# EAGLE design THS Joule Thief torch (EAGLE 6.4)
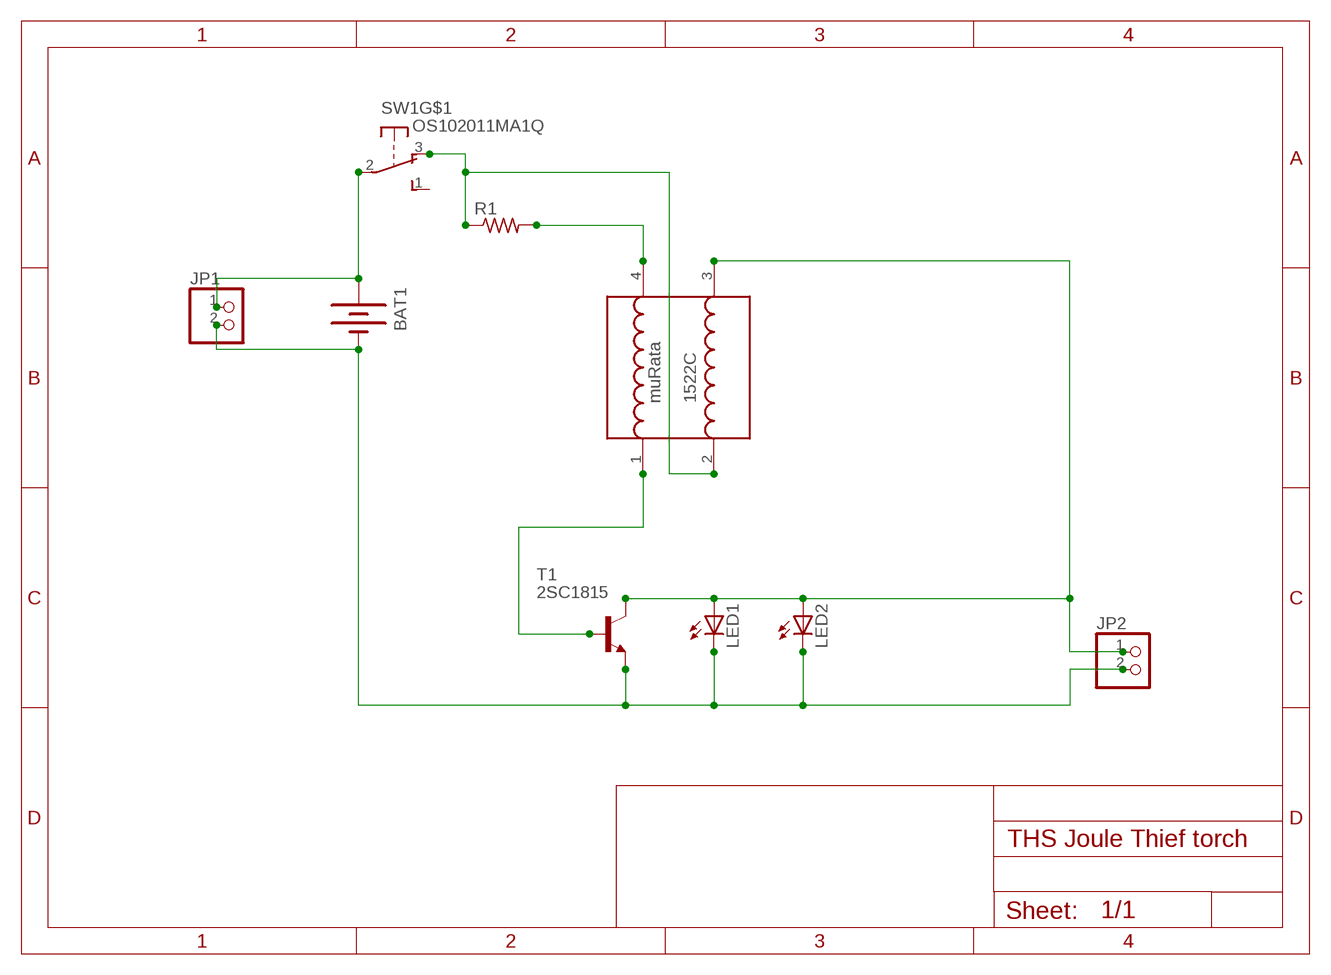
[diagram p0: schematic, sheet 1]

## Parts
BAT1  BATTERY  [BATTERY-AA-PANEL-AKIZUKI]
JP1  PINHD-1X2  [1X02]
JP2  PINHD-1X2  [1X02]
LED1  LED5MM  [LED5MM]
LED2  LED5MM  [LED5MM]
R1  R-US_0204/7  [0204/7]
SW1  OS102011MA1Q  [OS102011MA1Q]
T1  2SC1815  [TO92-ECB]
U$1  1522C_MURATA_AC-CHOKE  [AC-CHOKE_THROUGH_HOLE]

## Nets
GND: BAT1.- JP1.2 JP2.2 LED1.K(C) LED2.K(C) T1.E
N$2: R1.2 U$1.4(COIL1_B)
N$5: T1.B U$1.1(COIL1_A)
N$6: BAT1.+ JP1.1 SW1.2(P)
N$15: JP2.1 LED1.A LED2.A T1.C U$1.3(COIL2_B)
VCC: R1.1 SW1.3(O) U$1.2(COIL2_A)
Unconnected: SW1.1(S) SW1.MT1(MT) SW1.MT2(MT)

## Library data of the parts
BAT1 = DIY-SciB.org:BATTERY: Battery Holders Various common sizes : AA, AAA, 20mm coin cell and 12mm coin cell. 20MM_4LEGS, BATT-10373
JP1 JP2 = pinhead:PINHD-1X2: PIN HEADER
LED1 LED2 = adafruit:LED: LED OSRAM: - CHIPLED LG R971, LG N971, LY N971, LG Q971, LY Q971, LO R971, LY R971 LH N974, LH R974 LS Q976, LO Q976, LY Q976 LO Q996 - Hyper CHIPLED LW Q18S LB Q993, LB Q99A, LB R99A - SideLED LS A670, LO A670, LY A670, LG A670, LP A670 LB A673, LV A673, LT A673, LW A673 LH A674 LY A675 LS A676, LA A676, LO A676, LY A676, LW A676 LS A679, LY A679, LG A679 - Hyper Micro SIDELED® LS Y876, LA Y876, LO Y876, LY Y876 LT Y87S - SmartLED LW L88C, LW L88S LB L89C, LB L89S, LG L890 LS L89K, LO L89K, LY L89K LS L896, LA L896, LO L896, LY L896 - TOPLED LS T670, LO T670, LY T670, LG T670, LP T670 LSG T670, LSP T670, LSY T670, LOP T670, LYG T670 LG T671, LOG T671, LSG T671 LB T673, LV T673, LT T673, LW T673 LH T674 LS T676, LA T676, LO T676, LY T676, LB T676, LH T676, LSB T676, LW T676 LB T67C, LV T67C, LT T67C, LS T67K, LO T67K, LY T67K, LW E67C LS E67B, LA E67B, LO E67B, LY E67B, LB E67C, LV E67C, LT E67C LW T67C LS T679, LY T679, LG T679 LS T770, LO T770, LY T770, LG T770, LP T770 LB T773, LV T773, LT T773, LW T773 LH T774 LS E675, LA E675, LY E675, LS T675 LS T776, LA T776, LO T776, LY T776, LB T776 LHGB T686 LT T68C, LB T68C - Hyper Mini TOPLED® LB M676 - Mini TOPLED Santana® LG M470 LS M47K, LO M47K, LY M47K Source: http://www.osram.convergy.de/
R1 = adafruit:R-US_: RESISTOR, American symbol
SW1 = adafruit:OS102011MA1Q: OS10201MA1Q through-hole right angle switch http://www.ladyada.net/library/eagle
T1 = transistor:2SC1815: NPN EPITAXIAL TRANSISTOR Source: TOSHIBA .. 2SC1815 1.pdf
U$1 = DIY-SciB.org:1522C_MURATA_AC-CHOKE: muRata AC-choke 1522C Two coils wound around a core No data available online. From the Tokyo HackerSpace auction buy.

## Board
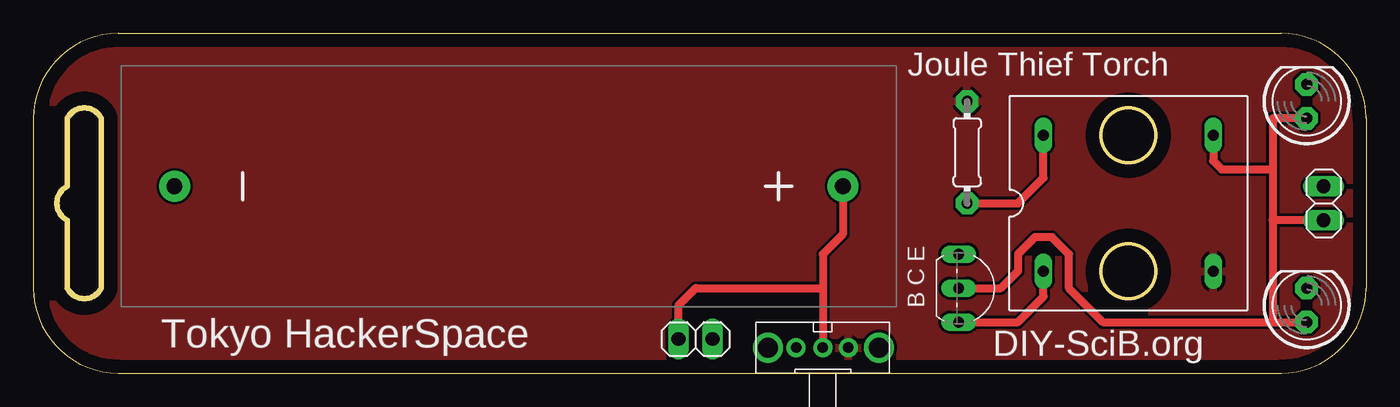
[diagram p1: board, top side]
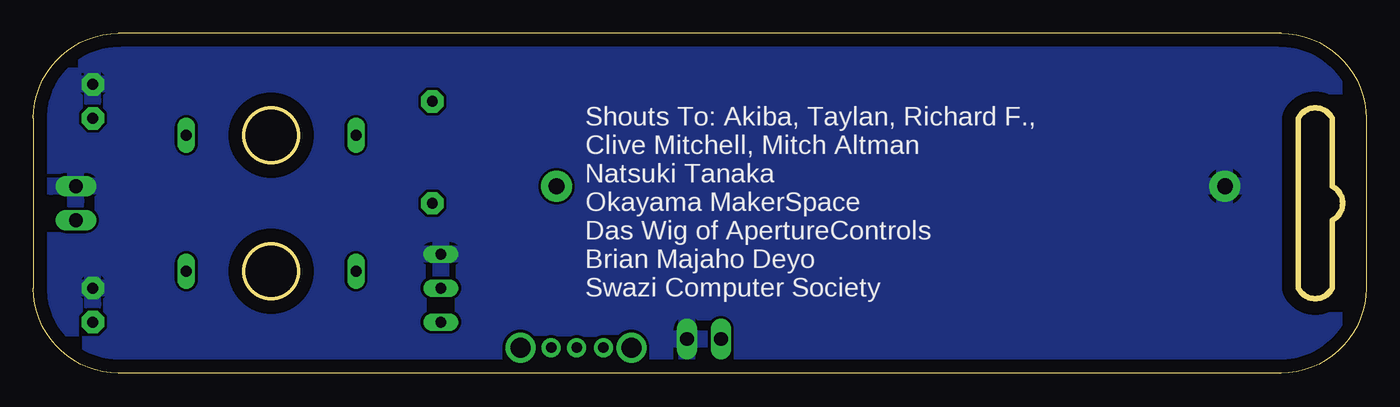
[diagram p2: board, bottom side, seen from below]

Size 99.69 x 25.4 mm. Coordinates in mm from the lower left corner, seen from the top.
Outline: 0,19.05 0,6.35 arc90 6.35,0 93.34,0 arc90 99.69,6.35 99.69,19.05 arc90 93.34,25.4 6.35,25.4 arc90 0,19.05
Outline: 2.54,19.05 arc-127 5.08,19.05 5.08,6.35 arc-127 2.54,6.35 2.54,11.43 arc-127 2.54,13.97 2.54,19.05
Outline: circle at 81.92,17.78 radius 2.03
Outline: circle at 81.92,7.62 radius 2.03
Copper layers (1*16): Top 0.035mm / dielectric 1.5mm / Bottom 0.035mm
Design rules "default": minimum track width 10mil, minimum drill 24mil, track to track 8mil, track to pad 8mil, pad to pad 8mil, via to via 8mil, smd to smd 8mil, copper to edge 40mil, drill to drill 8mil, minimum pad ring 10mil, minimum via ring 8mil, stop-mask expansion 4mil, vias tented up to drill 0mil, thermal gap 10mil

### Footprints (pad centres in the part's own frame; a part is rotated, then mirrored left to right if it is on the bottom)
BATTERY-AA-PANEL-AKIZUKI = drill 1.17 pad 2.3: + 25,0; - -25,0
1X02 = drill 1.016 long: 1 -1.27,0; 2 1.27,0
LED5MM = drill 0.813 pad 1.676 octagon: A -1.27,0; K 1.27,0
0204/7 = drill 0.813 pad 1.676 octagon: 1 -3.81,0; 2 3.81,0
OS102011MA1Q = drill 0.8 pad 1.422: 1 -2,0; 2 0,0; 3 1.9,0 | drill 1.5 pad 2.184: MT1 -4.1,0; MT2 4.2,0
TO92-ECB = drill 0.813 long: B 2.54,0; C 0,0; E -2.54,0
AC-CHOKE_THROUGH_HOLE = drill 0.813 long: 1 -6.35,-5.08; 2 6.35,-5.08; 3 6.35,5.08; 4 -6.35,5.08

### Placement (x,y rotation side)
BAT1  35.56,13.97 0 top
JP1  49.53,2.54 0 top
JP2  96.52,12.7 90 top
LED1  95.25,5.08 90 top
LED2  95.25,20.32 90 top
R1  69.85,16.51 270 top
SW1  59.05,1.91 0 top
T1  69.22,6.35 270 top
U$1  81.92,12.7 0 top

### Tracks (layer width: path | path; a pad name or v marks a point on that pad's centre or on a via)
GND
  pour Bottom: 0,30.48 arc90 -1.27,29.21 -1.27,-1.27 101.6,-1.27 101.6,30.48
N$2
  Top 0.61: R1.2 73.66,12.7 75.56,14.61 U$1.4
N$5
  Top 0.61: T1.B 73.66,3.81 75.56,5.71 U$1.1
N$6
  Top 0.61: BAT1.+ 60.56,10.39 59.05,8.89 59.05,6.35 | 59.05,6.35 SW1.2 | JP1.1 48.26,5.08 49.53,6.35 59.05,6.35
N$15
  Top 0.61: JP2.1 92.71,11.43 | 92.71,11.43 92.71,3.81 | 92.71,3.81 LED1.A | LED2.A 92.71,19.05 92.71,15.24 | 92.71,15.24 92.71,11.43 | U$1.3 88.27,15.88 88.9,15.24 92.71,15.24 | T1.C 72.39,6.35 73.66,7.62 73.66,8.89 74.93,10.16 76.2,10.16 77.47,8.89 77.47,6.35 80.01,3.81 92.71,3.81
VCC
  pour Top: -1.27,26.67 -1.27,-1.27 101.6,-1.27 101.6,26.67

### Text on the board
tNames: Joule Thief Torch | B C E | Tokyo HackerSpace | DIY-SciB.org
bNames: Shouts To: Akiba, Taylan, Richard F., / Clive Mitchell, Mitch Altman / Natsuki Tanaka / Okayama MakerSpace / Das Wig of ApertureControls / Brian Majaho Deyo / Swazi Computer Society